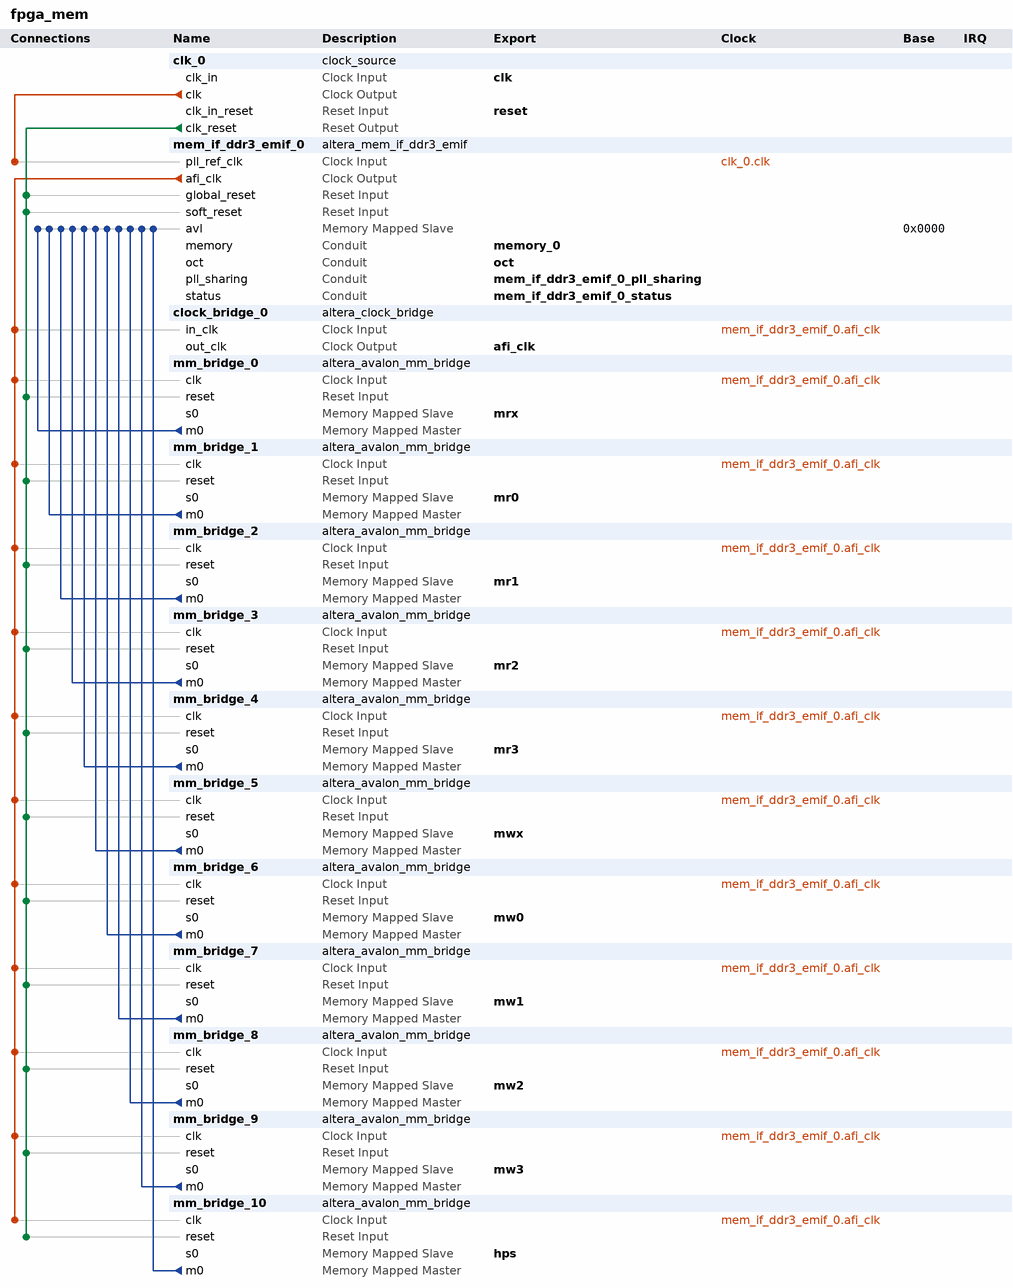
[diagram p0: system contents]
# Platform Designer (Qsys) system fpga_mem, Cyclone V 5CSXFC6D6F31C6
# Parameters at their usual value, and those the tool derives, are not listed.
package require -exact qsys 13.1
create_system fpga_mem
set_project_property DEVICE_FAMILY {Cyclone V}
set_project_property DEVICE 5CSXFC6D6F31C6

add_instance clk_0 clock_source 13.1
set_instance_parameter_value clk_0 clockFrequency 50000000

add_instance mem_if_ddr3_emif_0 altera_mem_if_ddr3_emif 13.1
set_instance_parameter_value mem_if_ddr3_emif_0 MEM_VENDOR JEDEC
set_instance_parameter_value mem_if_ddr3_emif_0 MEM_FORMAT DISCRETE
set_instance_parameter_value mem_if_ddr3_emif_0 MEM_CLK_FREQ_MAX 400.0
set_instance_parameter_value mem_if_ddr3_emif_0 MEM_ROW_ADDR_WIDTH 15
set_instance_parameter_value mem_if_ddr3_emif_0 MEM_COL_ADDR_WIDTH 10
set_instance_parameter_value mem_if_ddr3_emif_0 MEM_DQ_WIDTH 32
set_instance_parameter_value mem_if_ddr3_emif_0 MEM_BANKADDR_WIDTH 3
set_instance_parameter_value mem_if_ddr3_emif_0 MEM_WTCL 5
set_instance_parameter_value mem_if_ddr3_emif_0 MEM_TCL 6
set_instance_parameter_value mem_if_ddr3_emif_0 TIMING_TIS 200
set_instance_parameter_value mem_if_ddr3_emif_0 TIMING_TIH 275
set_instance_parameter_value mem_if_ddr3_emif_0 TIMING_TDS 75
set_instance_parameter_value mem_if_ddr3_emif_0 TIMING_TDH 150
set_instance_parameter_value mem_if_ddr3_emif_0 TIMING_TDQSQ 200
set_instance_parameter_value mem_if_ddr3_emif_0 TIMING_TDQSCK 400
set_instance_parameter_value mem_if_ddr3_emif_0 TIMING_TDQSS 0.25
set_instance_parameter_value mem_if_ddr3_emif_0 TIMING_TQSH 0.38
set_instance_parameter_value mem_if_ddr3_emif_0 TIMING_TDSH 0.2
set_instance_parameter_value mem_if_ddr3_emif_0 TIMING_TDSS 0.2
set_instance_parameter_value mem_if_ddr3_emif_0 MEM_TRAS_NS 37.5
set_instance_parameter_value mem_if_ddr3_emif_0 MEM_TRCD_NS 15.0
set_instance_parameter_value mem_if_ddr3_emif_0 MEM_TRP_NS 15.0
set_instance_parameter_value mem_if_ddr3_emif_0 MEM_TRFC_NS 300.0
set_instance_parameter_value mem_if_ddr3_emif_0 MEM_TWTR 4
set_instance_parameter_value mem_if_ddr3_emif_0 MEM_TFAW_NS 50.0
set_instance_parameter_value mem_if_ddr3_emif_0 MEM_TRRD_NS 13.2
set_instance_parameter_value mem_if_ddr3_emif_0 MEM_TRTP_NS 13.2
set_instance_parameter_value mem_if_ddr3_emif_0 RATE Half
set_instance_parameter_value mem_if_ddr3_emif_0 MEM_CLK_FREQ 300.0
set_instance_parameter_value mem_if_ddr3_emif_0 SPEED_GRADE 6
set_instance_parameter_value mem_if_ddr3_emif_0 HARD_EMIF false
set_instance_parameter_value mem_if_ddr3_emif_0 POWER_OF_TWO_BUS false
set_instance_parameter_value mem_if_ddr3_emif_0 AVL_MAX_SIZE 32
set_instance_parameter_value mem_if_ddr3_emif_0 PRIORITY_PORT 1,1,1,1,1,1
set_instance_parameter_value mem_if_ddr3_emif_0 CPORT_TYPE_PORT Bidirectional,Bidirectional,Bidirectional,Bidirectional,Bidirectional,Bidirectional
set_instance_parameter_value mem_if_ddr3_emif_0 REF_CLK_FREQ 50.0
set_instance_parameter_value mem_if_ddr3_emif_0 DEFAULT_FAST_SIM_MODEL true
set_instance_parameter_value mem_if_ddr3_emif_0 EXPORT_AFI_HALF_CLK true
set_instance_parameter_value mem_if_ddr3_emif_0 PLL_LOCATION Top_Bottom
set_instance_parameter_value mem_if_ddr3_emif_0 CALIBRATION_MODE Skip
set_instance_parameter_value mem_if_ddr3_emif_0 USER_DEBUG_LEVEL 1
set_instance_parameter_value mem_if_ddr3_emif_0 TIMING_BOARD_MAX_CK_DELAY 0.03
set_instance_parameter_value mem_if_ddr3_emif_0 TIMING_BOARD_MAX_DQS_DELAY 0.03
set_instance_parameter_value mem_if_ddr3_emif_0 TIMING_BOARD_SKEW_CKDQS_DIMM_MIN 0.0
set_instance_parameter_value mem_if_ddr3_emif_0 TIMING_BOARD_SKEW_CKDQS_DIMM_MAX 0.0
set_instance_parameter_value mem_if_ddr3_emif_0 TIMING_BOARD_SKEW_WITHIN_DQS 0.01
set_instance_parameter_value mem_if_ddr3_emif_0 TIMING_BOARD_SKEW_BETWEEN_DQS 0.08
set_instance_parameter_value mem_if_ddr3_emif_0 TIMING_BOARD_DQ_TO_DQS_SKEW 0.0
set_instance_parameter_value mem_if_ddr3_emif_0 TIMING_BOARD_AC_SKEW 0.03
set_instance_parameter_value mem_if_ddr3_emif_0 TIMING_BOARD_AC_TO_CK_SKEW 0.0

add_instance clock_bridge_0 altera_clock_bridge 13.1
set_instance_parameter_value clock_bridge_0 DERIVED_CLOCK_RATE 150000000
set_instance_parameter_value clock_bridge_0 EXPLICIT_CLOCK_RATE 200

add_instance mm_bridge_0 altera_avalon_mm_bridge 13.1
set_instance_parameter_value mm_bridge_0 DATA_WIDTH 128
set_instance_parameter_value mm_bridge_0 ADDRESS_WIDTH 26
set_instance_parameter_value mm_bridge_0 ADDRESS_UNITS WORDS
set_instance_parameter_value mm_bridge_0 MAX_BURST_SIZE 32
set_instance_parameter_value mm_bridge_0 MAX_PENDING_RESPONSES 4

add_instance mm_bridge_1 altera_avalon_mm_bridge 13.1
set_instance_parameter_value mm_bridge_1 DATA_WIDTH 128
set_instance_parameter_value mm_bridge_1 ADDRESS_WIDTH 26
set_instance_parameter_value mm_bridge_1 ADDRESS_UNITS WORDS
set_instance_parameter_value mm_bridge_1 MAX_BURST_SIZE 32
set_instance_parameter_value mm_bridge_1 MAX_PENDING_RESPONSES 4

add_instance mm_bridge_2 altera_avalon_mm_bridge 13.1
set_instance_parameter_value mm_bridge_2 DATA_WIDTH 128
set_instance_parameter_value mm_bridge_2 ADDRESS_WIDTH 26
set_instance_parameter_value mm_bridge_2 ADDRESS_UNITS WORDS
set_instance_parameter_value mm_bridge_2 MAX_BURST_SIZE 32
set_instance_parameter_value mm_bridge_2 MAX_PENDING_RESPONSES 4

add_instance mm_bridge_3 altera_avalon_mm_bridge 13.1
set_instance_parameter_value mm_bridge_3 DATA_WIDTH 128
set_instance_parameter_value mm_bridge_3 ADDRESS_WIDTH 26
set_instance_parameter_value mm_bridge_3 ADDRESS_UNITS WORDS
set_instance_parameter_value mm_bridge_3 MAX_BURST_SIZE 32
set_instance_parameter_value mm_bridge_3 MAX_PENDING_RESPONSES 4

add_instance mm_bridge_4 altera_avalon_mm_bridge 13.1
set_instance_parameter_value mm_bridge_4 DATA_WIDTH 128
set_instance_parameter_value mm_bridge_4 ADDRESS_WIDTH 26
set_instance_parameter_value mm_bridge_4 ADDRESS_UNITS WORDS
set_instance_parameter_value mm_bridge_4 MAX_BURST_SIZE 32
set_instance_parameter_value mm_bridge_4 MAX_PENDING_RESPONSES 4

add_instance mm_bridge_5 altera_avalon_mm_bridge 13.1
set_instance_parameter_value mm_bridge_5 DATA_WIDTH 128
set_instance_parameter_value mm_bridge_5 ADDRESS_WIDTH 26
set_instance_parameter_value mm_bridge_5 ADDRESS_UNITS WORDS
set_instance_parameter_value mm_bridge_5 MAX_BURST_SIZE 32
set_instance_parameter_value mm_bridge_5 MAX_PENDING_RESPONSES 4

add_instance mm_bridge_6 altera_avalon_mm_bridge 13.1
set_instance_parameter_value mm_bridge_6 DATA_WIDTH 128
set_instance_parameter_value mm_bridge_6 ADDRESS_WIDTH 26
set_instance_parameter_value mm_bridge_6 ADDRESS_UNITS WORDS
set_instance_parameter_value mm_bridge_6 MAX_BURST_SIZE 32
set_instance_parameter_value mm_bridge_6 MAX_PENDING_RESPONSES 4

add_instance mm_bridge_7 altera_avalon_mm_bridge 13.1
set_instance_parameter_value mm_bridge_7 DATA_WIDTH 128
set_instance_parameter_value mm_bridge_7 ADDRESS_WIDTH 26
set_instance_parameter_value mm_bridge_7 ADDRESS_UNITS WORDS
set_instance_parameter_value mm_bridge_7 MAX_BURST_SIZE 32
set_instance_parameter_value mm_bridge_7 MAX_PENDING_RESPONSES 4

add_instance mm_bridge_8 altera_avalon_mm_bridge 13.1
set_instance_parameter_value mm_bridge_8 DATA_WIDTH 128
set_instance_parameter_value mm_bridge_8 ADDRESS_WIDTH 26
set_instance_parameter_value mm_bridge_8 ADDRESS_UNITS WORDS
set_instance_parameter_value mm_bridge_8 MAX_BURST_SIZE 32
set_instance_parameter_value mm_bridge_8 MAX_PENDING_RESPONSES 4

add_instance mm_bridge_9 altera_avalon_mm_bridge 13.1
set_instance_parameter_value mm_bridge_9 DATA_WIDTH 128
set_instance_parameter_value mm_bridge_9 ADDRESS_WIDTH 26
set_instance_parameter_value mm_bridge_9 ADDRESS_UNITS WORDS
set_instance_parameter_value mm_bridge_9 MAX_BURST_SIZE 32
set_instance_parameter_value mm_bridge_9 MAX_PENDING_RESPONSES 4

add_instance mm_bridge_10 altera_avalon_mm_bridge 13.1
set_instance_parameter_value mm_bridge_10 DATA_WIDTH 128
set_instance_parameter_value mm_bridge_10 ADDRESS_WIDTH 26
set_instance_parameter_value mm_bridge_10 ADDRESS_UNITS WORDS
set_instance_parameter_value mm_bridge_10 MAX_BURST_SIZE 32
set_instance_parameter_value mm_bridge_10 MAX_PENDING_RESPONSES 4

# connections
add_connection clk_0.clk mem_if_ddr3_emif_0.pll_ref_clk clock
add_connection mem_if_ddr3_emif_0.afi_clk clock_bridge_0.in_clk clock
add_connection mem_if_ddr3_emif_0.afi_clk mm_bridge_0.clk clock
add_connection mem_if_ddr3_emif_0.afi_clk mm_bridge_1.clk clock
add_connection mem_if_ddr3_emif_0.afi_clk mm_bridge_2.clk clock
add_connection mem_if_ddr3_emif_0.afi_clk mm_bridge_3.clk clock
add_connection mem_if_ddr3_emif_0.afi_clk mm_bridge_4.clk clock
add_connection mem_if_ddr3_emif_0.afi_clk mm_bridge_5.clk clock
add_connection mem_if_ddr3_emif_0.afi_clk mm_bridge_6.clk clock
add_connection mem_if_ddr3_emif_0.afi_clk mm_bridge_7.clk clock
add_connection mem_if_ddr3_emif_0.afi_clk mm_bridge_8.clk clock
add_connection mem_if_ddr3_emif_0.afi_clk mm_bridge_9.clk clock
add_connection mem_if_ddr3_emif_0.afi_clk mm_bridge_10.clk clock
add_connection clk_0.clk_reset mem_if_ddr3_emif_0.global_reset reset
add_connection clk_0.clk_reset mem_if_ddr3_emif_0.soft_reset reset
add_connection clk_0.clk_reset mm_bridge_0.reset reset
add_connection clk_0.clk_reset mm_bridge_1.reset reset
add_connection clk_0.clk_reset mm_bridge_2.reset reset
add_connection clk_0.clk_reset mm_bridge_3.reset reset
add_connection clk_0.clk_reset mm_bridge_4.reset reset
add_connection clk_0.clk_reset mm_bridge_5.reset reset
add_connection clk_0.clk_reset mm_bridge_6.reset reset
add_connection clk_0.clk_reset mm_bridge_7.reset reset
add_connection clk_0.clk_reset mm_bridge_8.reset reset
add_connection clk_0.clk_reset mm_bridge_9.reset reset
add_connection clk_0.clk_reset mm_bridge_10.reset reset
add_connection mm_bridge_0.m0 mem_if_ddr3_emif_0.avl avalon
set_connection_parameter_value mm_bridge_0.m0/mem_if_ddr3_emif_0.avl baseAddress 0x0000
add_connection mm_bridge_1.m0 mem_if_ddr3_emif_0.avl avalon
set_connection_parameter_value mm_bridge_1.m0/mem_if_ddr3_emif_0.avl baseAddress 0x0000
add_connection mm_bridge_2.m0 mem_if_ddr3_emif_0.avl avalon
set_connection_parameter_value mm_bridge_2.m0/mem_if_ddr3_emif_0.avl baseAddress 0x0000
add_connection mm_bridge_3.m0 mem_if_ddr3_emif_0.avl avalon
set_connection_parameter_value mm_bridge_3.m0/mem_if_ddr3_emif_0.avl baseAddress 0x0000
add_connection mm_bridge_4.m0 mem_if_ddr3_emif_0.avl avalon
set_connection_parameter_value mm_bridge_4.m0/mem_if_ddr3_emif_0.avl baseAddress 0x0000
add_connection mm_bridge_5.m0 mem_if_ddr3_emif_0.avl avalon
set_connection_parameter_value mm_bridge_5.m0/mem_if_ddr3_emif_0.avl baseAddress 0x0000
add_connection mm_bridge_6.m0 mem_if_ddr3_emif_0.avl avalon
set_connection_parameter_value mm_bridge_6.m0/mem_if_ddr3_emif_0.avl baseAddress 0x0000
add_connection mm_bridge_7.m0 mem_if_ddr3_emif_0.avl avalon
set_connection_parameter_value mm_bridge_7.m0/mem_if_ddr3_emif_0.avl baseAddress 0x0000
add_connection mm_bridge_8.m0 mem_if_ddr3_emif_0.avl avalon
set_connection_parameter_value mm_bridge_8.m0/mem_if_ddr3_emif_0.avl baseAddress 0x0000
add_connection mm_bridge_9.m0 mem_if_ddr3_emif_0.avl avalon
set_connection_parameter_value mm_bridge_9.m0/mem_if_ddr3_emif_0.avl baseAddress 0x0000
add_connection mm_bridge_10.m0 mem_if_ddr3_emif_0.avl avalon
set_connection_parameter_value mm_bridge_10.m0/mem_if_ddr3_emif_0.avl baseAddress 0x0000

# exported interfaces
add_interface clk clock sink
set_interface_property clk EXPORT_OF clk_0.clk_in
add_interface reset reset sink
set_interface_property reset EXPORT_OF clk_0.clk_in_reset
add_interface memory_0 conduit end
set_interface_property memory_0 EXPORT_OF mem_if_ddr3_emif_0.memory
add_interface oct conduit end
set_interface_property oct EXPORT_OF mem_if_ddr3_emif_0.oct
add_interface mem_if_ddr3_emif_0_status conduit end
set_interface_property mem_if_ddr3_emif_0_status EXPORT_OF mem_if_ddr3_emif_0.status
add_interface mem_if_ddr3_emif_0_pll_sharing conduit end
set_interface_property mem_if_ddr3_emif_0_pll_sharing EXPORT_OF mem_if_ddr3_emif_0.pll_sharing
add_interface afi_clk clock source
set_interface_property afi_clk EXPORT_OF clock_bridge_0.out_clk
add_interface mrx avalon slave
set_interface_property mrx EXPORT_OF mm_bridge_0.s0
add_interface mr0 avalon slave
set_interface_property mr0 EXPORT_OF mm_bridge_1.s0
add_interface mr1 avalon slave
set_interface_property mr1 EXPORT_OF mm_bridge_2.s0
add_interface mr2 avalon slave
set_interface_property mr2 EXPORT_OF mm_bridge_3.s0
add_interface mr3 avalon slave
set_interface_property mr3 EXPORT_OF mm_bridge_4.s0
add_interface mwx avalon slave
set_interface_property mwx EXPORT_OF mm_bridge_5.s0
add_interface mw0 avalon slave
set_interface_property mw0 EXPORT_OF mm_bridge_6.s0
add_interface mw1 avalon slave
set_interface_property mw1 EXPORT_OF mm_bridge_7.s0
add_interface mw2 avalon slave
set_interface_property mw2 EXPORT_OF mm_bridge_8.s0
add_interface mw3 avalon slave
set_interface_property mw3 EXPORT_OF mm_bridge_9.s0
add_interface hps avalon slave
set_interface_property hps EXPORT_OF mm_bridge_10.s0

set_interconnect_requirement {$system} qsys_mm.clockCrossingAdapter HANDSHAKE
set_interconnect_requirement {$system} qsys_mm.maxAdditionalLatency 1

save_system fpga_mem.qsys
